# Altium project Control128v4.PrjPcb
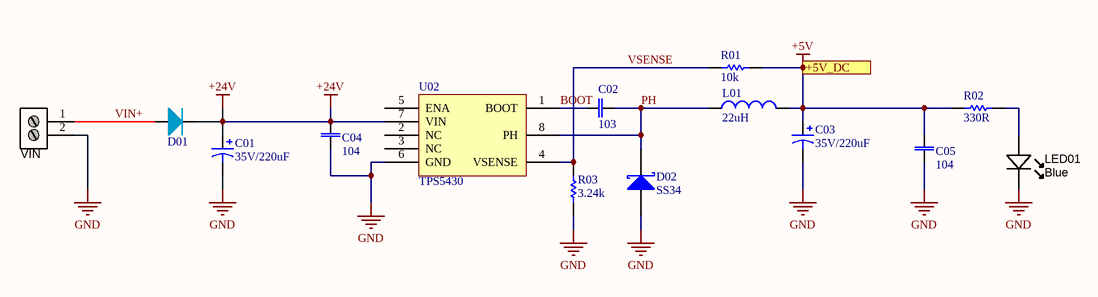
[diagram p0: 0.powerv4.SchDoc]
4 sheets, 98 parts. Net scope: flat (ports and power ports of the same name join across sheets).
Board file: control128v4.PcbDoc
Sheets:
  0.powerv4.SchDoc
  1.mcuv4.SchDoc
  2.rs485v4.SchDoc
  3.relayoutv4.SchDoc

## Sheet 0.powerv4.SchDoc
size A4; DocumentNumber: 1; SheetNumber: 1; SheetTotal: 4

### Parts
C01  value 35V/220uF  [CAPE3.5-5.0MM_Rad_10x14mm]  (hidden comment: Tụ nhôm cắm35V/220uF)
C02  value 103  [CAP 0805]  (hidden comment: Tụ điện dán 0805103)
C03  value 35V/220uF  [CAPE3.5-5.0MM_Rad_10x14mm]  (hidden comment: Tụ nhôm cắm35V/220uF)
C04  value 104  [CAP 0805]  (hidden comment: Tụ điện dán 0805104)
C05  value 104  [CAP 0805]  (hidden comment: Tụ điện dán 0805104)
D01  Đi ốt dán M7chân DO-214AB  [DO-214AA]  (value not drawn)
D02  SS34  [SMD diode]
L01  value 22uH  [Inductor 12x12x6]  (hidden comment: Cuộn cảm dán22uH)
LED01  Blue  [LED-0805-K]
R01  value 10k  [RES 0805]  (hidden comment: Điện trở dán 080510k)
R02  value 330R  [RES 0805]  (hidden comment: Điện trở dán 0805330R)
R03  value 3.24k  [RES 0805]  (hidden comment: Điện trở dán 08053.24k)
U02  TPS5430  [SOIC 8]
VIN  Giắc xanh 5.08mm  [2P_PCB1]  (value not drawn)

### Ports
+5V_DC

### Nets
+5V: C03.1 C05.2 L01.2 R01.1 R02.2 ; port +5V_DC
+24V: C01.1 C04.2 D01.2(K) U02.7(VIN)
GND: C01.2 C03.2 C04.1 C05.1 D02.1(A) LED01.K R03.1 U02.6(GND) VIN.2
BOOT: C02.1 U02.1(BOOT)
PH: C02.2 D02.2(K) L01.1 U02.8(PH)
VIN+: D01.1(A) VIN.1
VSENSE: R01.2 R03.2 U02.4(VSENSE)
NetLED01_A: LED01.A R02.1

Not connected (* = marked no-connect by the designer): U02 2(NC) 3(NC) 5(ENA)

### Library data of the parts
C01 C03 = Cap: cm: Tụ nhôm cắm
C02 C04 C05 = CAP NP: Capacitor non polarized; cm1: Tụ điện dán 0603; cm3: Tụ điện dán 1206; cm2: Tụ điện dán 0805
D01 = Diode: pin to pad: 1>A 2>K; cm1: Đi ốt cắm; vl2: FR307; vl3: TVS 1.5KE300A 19A 300V; vl4: HER508 5A 1000V; cm2: Đi ốt dán M7; vl5: chân DO-214AB
D02 = Diode Schottky: pin to pad: 1>A 2>K
L01 = Inductor: cm2: Cuộn cảm cắm; cm1: Cuộn cảm dán
LED01 = LED_SMD_Blue_0805_100mcd: LED 0805 SMD Blue 100mcd 470nm; Manufacturer 1: Ligitek; Manufacturer Part Number 1: LG-170DBKZ-CT; Material: InGaN/GaN; Ratings: 100 mcd; 470 nm; Package / Case: 0805; Value: Blue; Color: Blue
R01 R02 R03 = Res: Resistor; cm1: Điện trở dán 0603; cm2: Điện trở cắm 1/4W; cm4: Điện trở dán 1206; cm3: Điện trở dán 0805
VIN = 2P_ScrewTerm_90S_3.81MM: Terminal Block Screw Type THT 2-Position 3.81mm pitch; Manufacturer 1: Tyco Electronics; Manufacturer Part Number 1: 1776113-2; Value: 2 position; Pitch: 0.150" (3.81mm); Positions Per Level: 2; Package / Case: Side Entry; 3.81mm pitch; Category: Connectors Interconnects; Color: Black; Supplier 1: Digi-Key; Supplier Part Number 1: A97976-ND; vl: Giắc xanh 5.08mm

## Sheet 1.mcuv4.SchDoc
size A3; DocumentNumber: 2; SheetNumber: 2; SheetTotal: 4; PageSetup: Record=PageOptions|CenterHorizontal=True|CenterVertical=True|PrintScale=0.73|XCorrection=1.00|YCorrection=1.00|PrintKind=1|BorderSize=5000000|LeftOffset=0|BottomOffset=0|Orientation=2|PaperLength=1000|PaperWidth=1000|Scale=100|PaperSource=7|PrintQuality=-3|MediaType=1|DitherType=10|PrintScaleMode=1|PaperKind=A4|PaperIndex=9
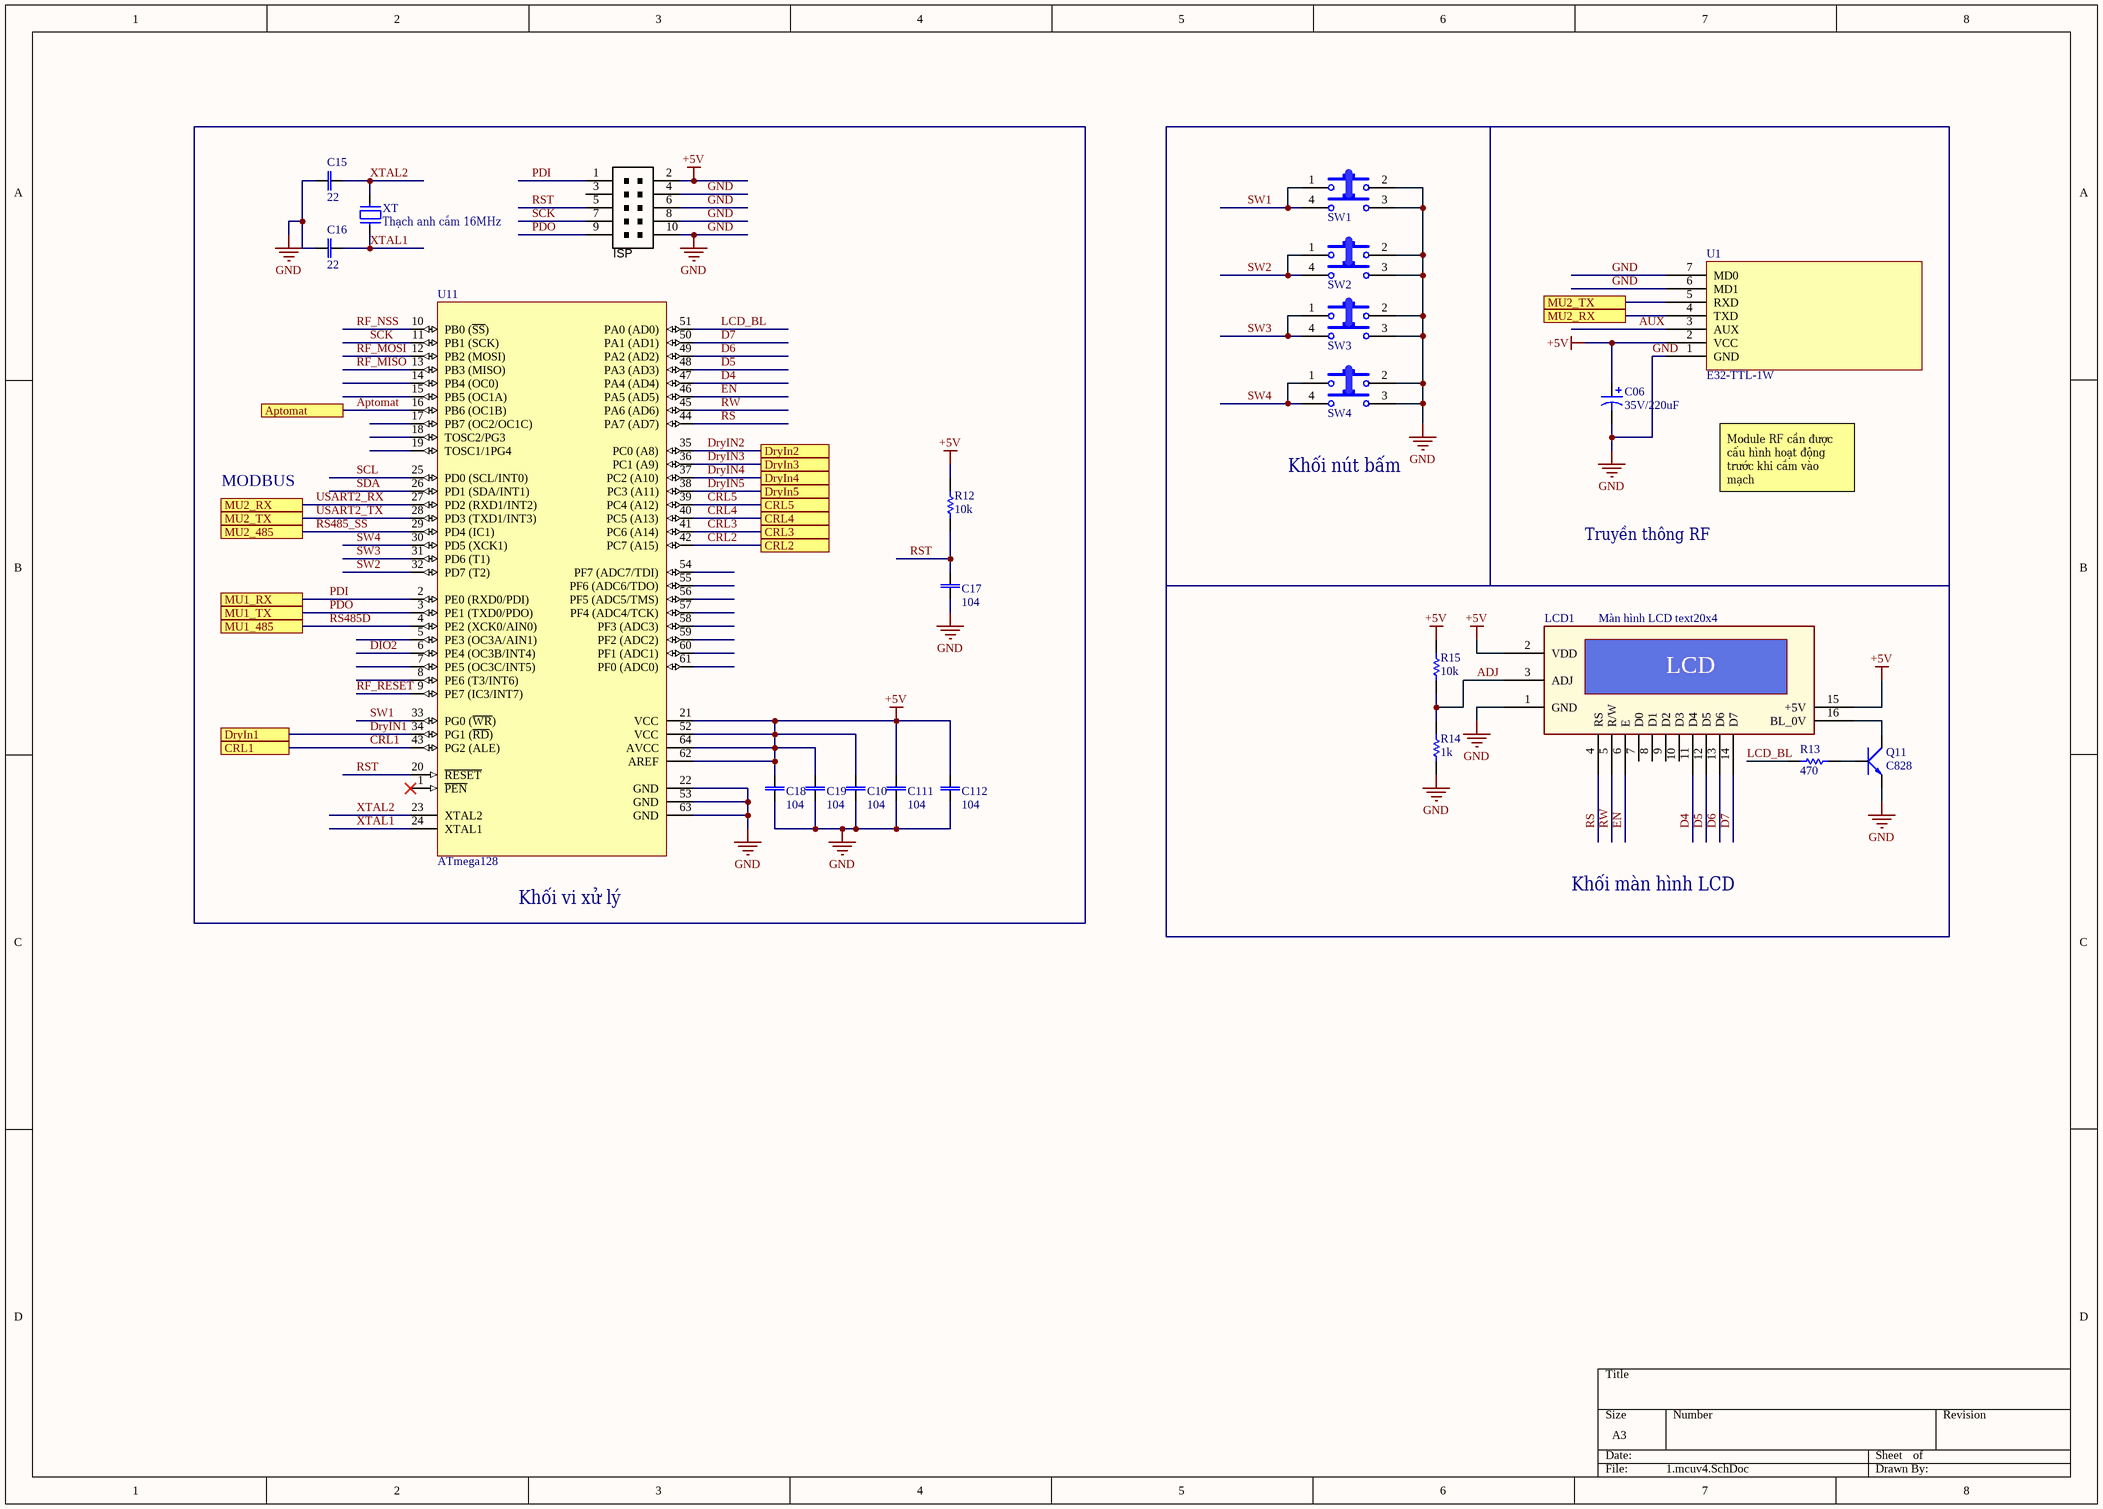
[diagram p1: 1.mcuv4.SchDoc]

### Parts
C06  value 35V/220uF  [CAPE3.5-5.0MM_Rad_10x14mm]  (hidden comment: Tụ nhôm cắm35V/220uF)
C10  value 104  [CAP 0805]  (hidden comment: Tụ điện dán 0805104)
C15  value 22  [CAP 0805]  (hidden comment: Tụ điện dán 080522)
C16  value 22  [CAP 0805]  (hidden comment: Tụ điện dán 080522)
C17  value 104  [CAP 0805]  (hidden comment: Tụ điện dán 0805104)
C18  value 104  [CAP 0805]  (hidden comment: Tụ điện dán 0805104)
C19  value 104  [CAP 0805]  (hidden comment: Tụ điện dán 0805104)
C111  value 104  [CAP 0805]  (hidden comment: Tụ điện dán 0805104)
C112  value 104  [CAP 0805]  (hidden comment: Tụ điện dán 0805104)
ISP  Giắc đôi 5x2 chân 2.54mm  [10P_PCB_HEADER_BRD_MNT]  (value not drawn)
LCD1  Màn hình LCD text20x4  [LCD 20x4]
Q11  C828  [SOT23 TOP]
R12  value 10k  [RES 0805]  (hidden comment: Điện trở dán 080510k)
R13  value 470  [RESC1608N_F]  (hidden comment: Điện trở dán 0805470)
R14  value 1k  [RES 0805]  (hidden comment: Điện trở dán 08051k)
R15  value 10k  [RES 0805]  (hidden comment: Điện trở dán 080510k)
SW1  Nút bấm 4 chân cắm12x12x17mm  [SW 12x12x4]  (value not drawn)
SW2  Nút bấm 4 chân cắm12x12x17mm  [SW 12x12x4]  (value not drawn)
SW3  Nút bấm 4 chân cắm12x12x17mm  [SW 12x12x4]  (value not drawn)
SW4  Nút bấm 4 chân cắm12x12x17mm  [SW 12x12x4]  (value not drawn)
U1  value E32-TTL-1W  [RF_AS32]
U11  ATmega128  [64A_N]
XT  Thạch anh cắm 16MHz  [XT2]

### Blocks framed on the sheet
Khối vi xử lý: C10 C15-C19 C111 C112 ISP R12 U11 XT

### Ports
Aptomat, CRL1, CRL2, CRL3, CRL4, CRL5, DryIn1, DryIn2, DryIn3, DryIn4, DryIn5, MU1_485, MU1_RX, MU1_TX, MU2_485, MU2_RX, MU2_TX

### Nets
+5V: C06.1 C10.2 C18.2 C19.2 C111.2 C112.2 ISP.2 LCD1.2(VDD) LCD1.15(+5V) R12.2 R15.2 U1.2(VCC) U11.21(VCC) U11.52(VCC) U11.62(AREF) U11.64(AVCC)
GND: C06.2 C10.1 C15.2 C16.2 C17.1 C18.1 C19.1 C111.1 C112.1 ISP.4 ISP.6 ISP.8 ISP.10 LCD1.1(GND) Q11.3(E) R14.1 SW1.2 SW1.3 SW2.2 SW2.3 SW3.2 SW3.3 SW4.2 SW4.3 U1.1(GND) U1.6(MD1) U1.7(MD0) U11.22(GND) U11.53(GND) U11.63(GND)
ADJ: LCD1.3(ADJ) R14.2 R15.1
Aptomat: U11.16(PB6_(OC1B)) ; port Aptomat
AUX: U1.3(AUX)
CRL1: U11.43(PG2_(ALE)) ; port CRL1
CRL2: U11.42(PC7_(A15)) ; port CRL2
CRL3: U11.41(PC6_(A14)) ; port CRL3
CRL4: U11.40(PC5_(A13)) ; port CRL4
CRL5: U11.39(PC4_(A12)) ; port CRL5
D4: LCD1.11(D4) U11.47(PA4_(AD4))
D5: LCD1.12(D5) U11.48(PA3_(AD3))
D6: LCD1.13(D6) U11.49(PA2_(AD2))
D7: LCD1.14(D7) U11.50(PA1_(AD1))
DIO2: U11.6(PE4_(OC3B/INT4))
DryIN1: U11.34(PG1_(~{RD})) ; port DryIn1
DryIN2: U11.35(PC0_(A8)) ; port DryIn2
DryIN3: U11.36(PC1_(A9)) ; port DryIn3
DryIN4: U11.37(PC2_(A10)) ; port DryIn4
DryIN5: U11.38(PC3_(A11)) ; port DryIn5
EN: LCD1.6(E) U11.46(PA5_(AD5))
LCD_BL: R13.2 U11.51(PA0_(AD0))
PDI: ISP.1 U11.2(PE0_(RXD0/PDI)) ; port MU1_RX
PDO: ISP.9 U11.3(PE1_(TXD0/PDO)) ; port MU1_TX
RF_MISO: U11.13(PB3_(MISO))
RF_MOSI: U11.12(PB2_(MOSI))
RF_NSS: U11.10(PB0_(~{SS}))
RF_RESET: U11.9(PE7_(IC3/INT7))
RS: LCD1.4(RS) U11.44(PA7_(AD7))
RS485_SS: U11.29(PD4_(IC1)) ; port MU2_485  [project net RD485]
RS485D: U11.4(PE2_(XCK0/AIN0)) ; port MU1_485
RST: C17.2 ISP.5 R12.1 U11.20(~{RESET})
RW: LCD1.5(R/W) U11.45(PA6_(AD6))
SCK: ISP.7 U11.11(PB1_(SCK))
SCL: U11.25(PD0_(SCL/INT0))
SDA: U11.26(PD1_(SDA/INT1))
SW1: SW1.1 SW1.4 U11.33(PG0_(~{WR}))
SW2: SW2.1 SW2.4 U11.32(PD7_(T2))
SW3: SW3.1 SW3.4 U11.31(PD6_(T1))
SW4: SW4.1 SW4.4 U11.30(PD5_(XCK1))
USART2_RX: U1.4(TXD) U11.27(PD2_(RXD1/INT2)) ; port MU2_RX
USART2_TX: U1.5(RXD) U11.28(PD3_(TXD1/INT3)) ; port MU2_TX
XTAL1: C16.1 U11.24(XTAL1) XT.1
XTAL2: C15.1 U11.23(XTAL2) XT.2
NetLCD1_16: LCD1.16(BL_0V) Q11.2(C)
NetQ11_1: Q11.1(B) R13.1

Not connected (* = marked no-connect by the designer): ISP 3; LCD1 7(D0) 8(D1) 9(D2) 10(D3); U11 1(~{PEN})* 5(PE3_(OC3A/AIN1)) 7(PE5_(OC3C/INT5)) 8(PE6_(T3/INT6)) 14(PB4_(OC0)) 15(PB5_(OC1A)) 17(PB7_(OC2/OC1C)) 18(TOSC2/PG3) 19(TOSC1/1PG4) 54(PF7_(ADC7/TDI)) 55(PF6_(ADC6/TDO)) 56(PF5_(ADC5/TMS)) 57(PF4_(ADC4/TCK)) 58(PF3_(ADC3)) 59(PF2_(ADC2)) 60(PF1_(ADC1)) 61(PF0_(ADC0))

### Notes on the sheet
- MODBUS
- (near SW4) Khối nút bấm
- Module RF cần được cấu hình hoạt động trước khi cắm vào mạch
- Truyền thông RF
- Khối màn hình LCD
- (in symbol LCD 16x2) LCD

### Library data of the parts
C06 = Cap: cm: Tụ nhôm cắm
C10 C15-C19 C111 C112 = CAP NP: as C02 on sheet 0.powerv4; cm2: Tụ điện dán 0805
ISP = CONN_HEADER_2x5P_0.100in_Male: Header THD 10 POS Double-row 2.54mm pitch; Manufacturer 1: 3M; Manufacturer Part Number 1: D2510-6002-AR; Pitch: 0.100" (2.54mm); Value: Double-row, 10 positions; QtyOverride: 1; Connector Type: Header, Shrouded; Number of Positions: 10; Package / Case: Connector header; 2.54mm pitch; Contact Type: Male Pin; Number of Rows: 2; Row Spacing: 0.100" (2.54mm); Contact Mating Length: 0.243" (6.17mm); ComponentLink1URL: http://multimedia.3m.com/mws/mediawebserver?66666UuZjcFSLXTtm8T_oxMcEVuQEcuZgVs6EVs6E666666--; ComponentLink1Description: http://multimedia.3m.com/mws/mediawebserver?66666UuZjcFSLXTtm8T_oxMcEVuQEcuZgVs6EVs6E666666--; Supplier 1: Digi-Key; Supplier Part Number 1: MHC10E-ND
LCD1 = LCD 16x2: Text LCD; vl1: 16x2; vl2: 20x4; cm1: Màn hình LCD text
Q11 = NPN: Transistor C828 C1815....
R12-R15 = Res: as R01 on sheet 0.powerv4; cm3: Điện trở dán 0805
SW1-SW4 = SW-4P-Small: pin to pad: 3>2 4>1; cm1: Nút bấm 4 chân cắm; vl1: 12x12x17mm
U1 = AS32-TTL-1W: Type1: Module thu phát không dây RF
U11 = ATmega128-16AC: 8-Bit AVR Microcontroller with 128K Bytes of In-System Programmable Flash Memory; Published: 17-Sep-2003; LatestRevisionDate: 13-Apr-2006; LatestRevisionNote: IPC-7351 Footprint Added.; DatasheetVersion: 2467G-AVR-09/02; PackageVersion: revB, Oct-2001; PackageReference: 64A; Publisher: Altium Limited; PackageDescription: 64-Pin Thin Quad Flat Pack 0.8 mm Pitch; Code_JEDEC: MS-026-AEB; ComponentLink1Description: Manufacturer Link; ComponentLink1URL: http://www.atmel.com; ComponentLink2Description: Datasheet; ComponentLink2URL: http://www.atmel.com/dyn/resources/prod_documents/doc2467.pdf
XT = Crystal

## Sheet 2.rs485v4.SchDoc
size A; DocumentNumber: 3; SheetNumber: 3; SheetTotal: 4; PageSetup: Record=PageOptions|CenterHorizontal=True|CenterVertical=True|PrintScale=1.09|XCorrection=1.00|YCorrection=1.00|PrintKind=1|BorderSize=5000000|LeftOffset=0|BottomOffset=0|Orientation=2|PaperLength=1000|PaperWidth=1000|Scale=100|PaperSource=15|PrintQuality=1200|MediaType=1|DitherType=10|PrintScaleMode=1|PaperKind=A4|PaperIndex=9
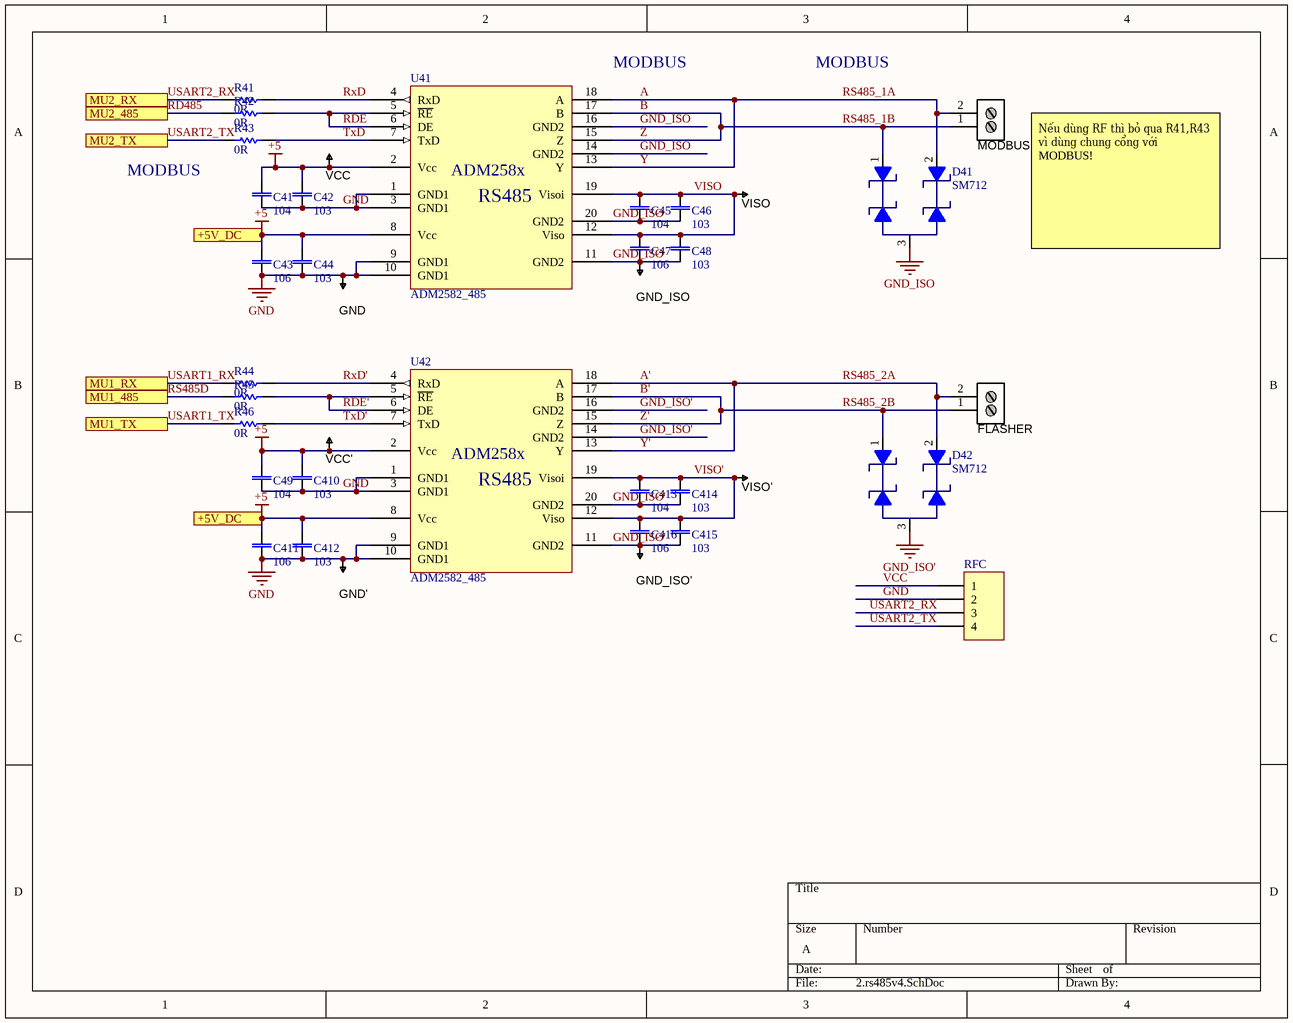
[diagram p2: 2.rs485v4.SchDoc]

### Parts
C41  value 104  [CAP 0805]  (hidden comment: Tụ điện dán 0805104)
C42  value 103  [CAP 0805]  (hidden comment: Tụ điện dán 0805103)
C43  value 106  [CAP 0805]  (hidden comment: Tụ điện dán 0805106)
C44  value 103  [CAP 0805]  (hidden comment: Tụ điện dán 0805103)
C45  value 104  [CAP 0805]  (hidden comment: Tụ điện dán 0805104)
C46  value 103  [CAP 0805]  (hidden comment: Tụ điện dán 0805103)
C47  value 106  [CAP 0805]  (hidden comment: Tụ điện dán 0805106)
C48  value 103  [CAP 0805]  (hidden comment: Tụ điện dán 0805103)
C49  value 104  [CAP 0805]  (hidden comment: Tụ điện dán 0805104)
C410  value 103  [CAP 0805]  (hidden comment: Tụ điện dán 0805103)
C411  value 106  [CAP 0805]  (hidden comment: Tụ điện dán 0805106)
C412  value 103  [CAP 0805]  (hidden comment: Tụ điện dán 0805103)
C413  value 104  [CAP 0805]  (hidden comment: Tụ điện dán 0805104)
C414  value 103  [CAP 0805]  (hidden comment: Tụ điện dán 0805103)
C415  value 103  [CAP 0805]  (hidden comment: Tụ điện dán 0805103)
C416  value 106  [CAP 0805]  (hidden comment: Tụ điện dán 0805106)
D41  SM712  [SOT23 TOP]
D42  SM712  [SOT23 TOP]
FLASHER  Giắc xanh 5.08mm  [2P_PCB1]  (value not drawn)
GND  TESTPOINT  [TP-R60]  (value not drawn)  (no BOM)
GND'  TESTPOINT  [TP-R60]  (value not drawn)  (no BOM)
GND_ISO  TESTPOINT  [TP-R60]  (value not drawn)  (no BOM)
GND_ISO'  TESTPOINT  [TP-R60]  (value not drawn)  (no BOM)
MODBUS  Giắc xanh 5.08mm  [2P_PCB1]  (value not drawn)
R41  value 0R  [RES 0805]  (hidden comment: Điện trở dán 08050R)
R42  value 0R  [RES 0805]  (hidden comment: Điện trở dán 08050R)
R43  value 0R  [RES 0805]  (hidden comment: Điện trở dán 08050R)
R44  value 0R  [RES 0805]  (hidden comment: Điện trở dán 08050R)
R45  value 0R  [RES 0805]  (hidden comment: Điện trở dán 08050R)
R46  value 0R  [RES 0805]  (hidden comment: Điện trở dán 08050R)
RFC  Header 4  [HDR1X4]  (value not drawn)
U41  ADM2582_485  [SO-20B]
U42  ADM2582_485  [SO-20B]
VCC  TESTPOINT  [TP-R60]  (value not drawn)  (no BOM)
VCC'  TESTPOINT  [TP-R60]  (value not drawn)  (no BOM)
VISO  TESTPOINT  [TP-R60]  (value not drawn)  (no BOM)
VISO'  TESTPOINT  [TP-R60]  (value not drawn)  (no BOM)

### Ports
+5V_DC, MU1_485, MU1_RX, MU1_TX, MU2_485, MU2_RX, MU2_TX

### Nets
+5: C41.2 C42.2 C43.2 C44.2 C49.2 C410.2 C411.2 C412.2 U41.2(Vcc) U41.8(Vcc) U42.2(Vcc) U42.8(Vcc) VCC.1 VCC'.1 ; port +5V_DC  [project net +5V]
GND: C41.1 C42.1 C43.1 C44.1 C49.1 C410.1 C411.1 C412.1 GND.1 GND'.1 RFC.2 U41.1(GND1) U41.3(GND1) U41.9(GND1) U41.10(GND1) U42.1(GND1) U42.3(GND1) U42.9(GND1) U42.10(GND1)
GND_ISO: C45.1 C46.1 C47.1 C48.1 D41.3(GND) GND_ISO.1 U41.11(GND2) U41.14(GND2) U41.16(GND2) U41.20(GND2)
GND_ISO': C413.1 C414.1 C415.1 C416.1 D42.3(GND) GND_ISO'.1 U42.11(GND2) U42.14(GND2) U42.16(GND2) U42.20(GND2)
A: D41.2(IO2) MODBUS.2 U41.13(Y) U41.18(A)  [also labelled RS485_1A, Y]
A': D42.2(IO2) FLASHER.2 U42.13(Y) U42.18(A)  [also labelled RS485_2A, Y']
B: D41.1(IO1) MODBUS.1 U41.15(Z) U41.17(B)  [also labelled RS485_1B, Z]
B': D42.1(IO1) FLASHER.1 U42.15(Z) U42.17(B)  [also labelled RS485_2B, Z']
RD485: R42.1 ; port MU2_485
RDE: R42.2 U41.5(~{RE}) U41.6(DE)
RDE': R45.2 U42.5(~{RE}) U42.6(DE)
RS485D: R45.1 ; port MU1_485
RxD: R41.2 U41.4(RxD)
RxD': R44.2 U42.4(RxD)
TxD: R43.2 U41.7(TxD)
TxD': R46.2 U42.7(TxD)
USART1_RX: R44.1 ; port MU1_RX  [project net PDI]
USART1_TX: R46.1 ; port MU1_TX  [project net PDO]
USART2_RX: R41.1 RFC.3 ; port MU2_RX
USART2_TX: R43.1 RFC.4 ; port MU2_TX
VCC: RFC.1
VISO: C45.2 C46.2 C47.2 C48.2 U41.12(Viso) U41.19(Visoi) VISO.1
VISO': C413.2 C414.2 C415.2 C416.2 U42.12(Viso) U42.19(Visoi) VISO'.1

### Notes on the sheet
- (near U41) MODBUS
- MODBUS
- Nếu dùng RF thì bỏ qua R41,R43 vì dùng chung cổng với  MODBUS!
- (in symbol ADM2582_485) ADM258x; RS485

### Library data of the parts
C41-C49 C410-C416 = CAP NP: as C02 on sheet 0.powerv4; cm2: Tụ điện dán 0805
D41 D42 = SM712: The SM712 transient voltage suppressor (TVS) diode  is designed for asymmetrical (12V to -7V) protection  in multi-point data transmission standard RS-485  applications.; pin to pad: 2>3 3>2
FLASHER MODBUS = 2P_ScrewTerm_90S_3.81MM: as VIN on sheet 0.powerv4; Package / Case: Side Entry; 3.81mm pitch; Category: Connectors Interconnects; Color: Black; Supplier 1: Digi-Key; Supplier Part Number 1: A97976-ND; vl: Giắc xanh 5.08mm
GND GND' GND_ISO GND_ISO' VCC VCC' VISO VISO' = TESTPOINT: SMD test pin
R41-R46 = Res: as R01 on sheet 0.powerv4; cm3: Điện trở dán 0805
RFC = Header 4: Header, 4-Pin; LatestRevisionDate: 17-Jul-2002; LatestRevisionNote: Re-released for DXP Platform.; Publisher: Altium Limited

## Sheet 3.relayoutv4.SchDoc
size A4; DocumentNumber: 4; SheetNumber: 4; SheetTotal: 4; PageSetup: Record=PageOptions|CenterHorizontal=True|CenterVertical=True|PrintScale=1.00|XCorrection=1.00|YCorrection=1.00|PrintKind=1|BorderSize=5000000|LeftOffset=0|BottomOffset=0|Orientation=2|PaperLength=1000|PaperWidth=1000|Scale=100|PaperSource=15|PrintQuality=1200|MediaType=1|DitherType=10|PrintScaleMode=1|PaperKind=A4|PaperIndex=9
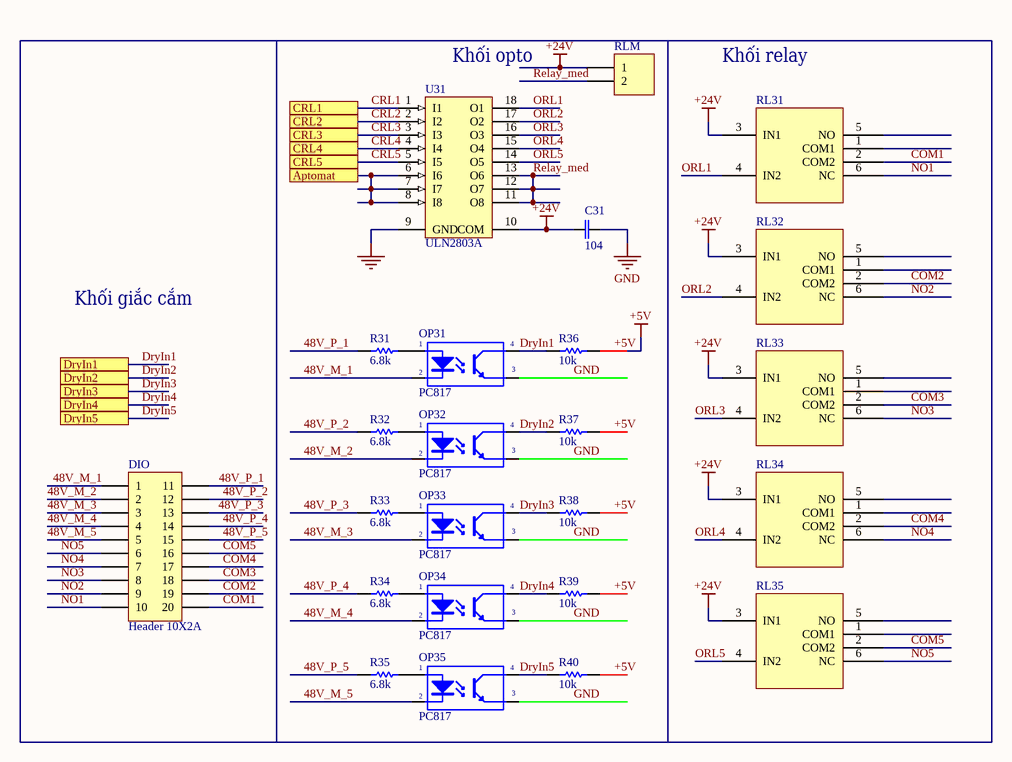
[diagram p3: 3.relayoutv4.SchDoc]

### Parts
C31  value 104  [CAP 0805]  (hidden comment: Tụ điện dán 0805104)
DIO  Header 10X2A  [HDR2X10_CEN]
OP31  PC817  [DIP4/W0.3]
OP32  PC817  [DIP4/W0.3]
OP33  PC817  [DIP4/W0.3]
OP34  PC817  [DIP4/W0.3]
OP35  PC817  [DIP4/W0.3]
R31  value 6.8k  [RESC3216N]  (hidden comment: Điện trở dán 12066.8k)
R32  value 6.8k  [RESC3216N]  (hidden comment: Điện trở dán 12066.8k)
R33  value 6.8k  [RESC3216N]  (hidden comment: Điện trở dán 12066.8k)
R34  value 6.8k  [RESC3216N]  (hidden comment: Điện trở dán 12066.8k)
R35  value 6.8k  [RESC3216N]  (hidden comment: Điện trở dán 12066.8k)
R36  value 10k  [RES 0805]  (hidden comment: Điện trở dán 080510k)
R37  value 10k  [RES 0805]  (hidden comment: Điện trở dán 080510k)
R38  value 10k  [RES 0805]  (hidden comment: Điện trở dán 080510k)
R39  value 10k  [RES 0805]  (hidden comment: Điện trở dán 080510k)
R40  value 10k  [RES 0805]  (hidden comment: Điện trở dán 080510k)
RL31  HK4100F_12V  [HK4100F]  (value not drawn)
RL32  HK4100F_12V  [HK4100F]  (value not drawn)
RL33  HK4100F_12V  [HK4100F]  (value not drawn)
RL34  HK4100F_12V  [HK4100F]  (value not drawn)
RL35  HK4100F_12V  [HK4100F]  (value not drawn)
RLM  Header 2  [HDR1X2]  (value not drawn)
U31  ULN2803A  [SOIC-18]

### Ports
Aptomat, CRL1, CRL2, CRL3, CRL4, CRL5, DryIn1, DryIn2, DryIn3, DryIn4, DryIn5

### Nets
+5V: R36.2 R37.2 R38.2 R39.2 R40.2
+24V: C31.2 RL31.3(IN1) RL32.3(IN1) RL33.3(IN1) RL34.3(IN1) RL35.3(IN1) RLM.1 U31.10(COM)
GND: C31.1 OP31.3(E) OP32.3(E) OP33.3(E) OP34.3(E) OP35.3(E) U31.9(GND)
48V_M_1: DIO.1 OP31.2(K)
48V_M_2: DIO.2 OP32.2(K)
48V_M_3: DIO.3 OP33.2(K)
48V_M_4: DIO.4 OP34.2(K)
48V_M_5: DIO.5 OP35.2(K)
48V_P_1: DIO.11 R31.1
48V_P_2: DIO.12 R32.1
48V_P_3: DIO.13 R33.1
48V_P_4: DIO.14 R34.1
48V_P_5: DIO.15 R35.1
Aptomat: U31.6(I6) U31.7(I7) U31.8(I8) ; port Aptomat
COM1: DIO.20 RL31.2(COM2)
COM2: DIO.19 RL32.2(COM2)
COM3: DIO.18 RL33.2(COM2)
COM4: DIO.17 RL34.2(COM2)
COM5: DIO.16 RL35.2(COM2)
CRL1: U31.1(I1) ; port CRL1
CRL2: U31.2(I2) ; port CRL2
CRL3: U31.3(I3) ; port CRL3
CRL4: U31.4(I4) ; port CRL4
CRL5: U31.5(I5) ; port CRL5
DryIN1: OP31.4(C) R36.1 ; port DryIn1
DryIN2: OP32.4(C) R37.1 ; port DryIn2
DryIN3: OP33.4(C) R38.1 ; port DryIn3
DryIN4: OP34.4(C) R39.1 ; port DryIn4
DryIN5: OP35.4(C) R40.1 ; port DryIn5
NO1: DIO.10 RL31.6(NC)
NO2: DIO.9 RL32.6(NC)
NO3: DIO.8 RL33.6(NC)
NO4: DIO.7 RL34.6(NC)
NO5: DIO.6 RL35.6(NC)
ORL1: RL31.4(IN2) U31.18(O1)
ORL2: RL32.4(IN2) U31.17(O2)
ORL3: RL33.4(IN2) U31.16(O3)
ORL4: RL34.4(IN2) U31.15(O4)
ORL5: RL35.4(IN2) U31.14(O5)
Relay_med: RLM.2 U31.11(O8) U31.12(O7) U31.13(O6)
NetOP31_1: OP31.1(A) R31.2
NetOP32_1: OP32.1(A) R32.2
NetOP33_1: OP33.1(A) R33.2
NetOP34_1: OP34.1(A) R34.2
NetOP35_1: OP35.1(A) R35.2

Not connected (* = marked no-connect by the designer): RL31 1(COM1) 5(NO); RL32 1(COM1) 5(NO); RL33 1(COM1) 5(NO); RL34 1(COM1) 5(NO); RL35 1(COM1) 5(NO)

### Notes on the sheet
- (near U31) Khối opto
- Khối relay
- Khối giắc cắm

### Library data of the parts
C31 = CAP NP: as C02 on sheet 0.powerv4; cm2: Tụ điện dán 0805
DIO = Header 10X2A: Header, 10-Pin, Dual row; LatestRevisionDate: 17-Jul-2002; LatestRevisionNote: Re-released for DXP Platform.; Publisher: Altium Limited
OP31-OP35 = PC817: Single Opto; Value: PC817
R31-R35 = Res: Resistor; cm1: Điện trở dán 0603; cm2: Điện trở cắm 1/4W; cm3: Điện trở dán 0805; cm4: Điện trở dán 1206
R36-R40 = Res: as R01 on sheet 0.powerv4; cm3: Điện trở dán 0805
RL31-RL35 = HK4100F
RLM = Header 2: Header, 2-Pin; LatestRevisionDate: 17-Jul-2002; LatestRevisionNote: Re-released for DXP Platform.; Publisher: Altium Limited
U31 = ULN2803A: High-Voltage, High-Current Darlington Array; LatestRevisionNote: Stylized 3D Model Added.; Publisher: Altium Limited; Value: ULN2803A

## Nets that join several sheets
+5V: 0.powerv4 (5 pins), 1.mcuv4 (16 pins), 2.rs485v4 (14 pins), 3.relayoutv4 (5 pins)
+24V: 0.powerv4 (C01.1 C04.2 D01.2 U02.7), 3.relayoutv4 (8 pins)
GND: 0.powerv4 (9 pins), 1.mcuv4 (30 pins), 2.rs485v4 (19 pins), 3.relayoutv4 (7 pins)
Aptomat: 1.mcuv4 (U11.16), 3.relayoutv4 (U31.6 U31.7 U31.8)
CRL1: 1.mcuv4 (U11.43), 3.relayoutv4 (U31.1)
CRL2: 1.mcuv4 (U11.42), 3.relayoutv4 (U31.2)
CRL3: 1.mcuv4 (U11.41), 3.relayoutv4 (U31.3)
CRL4: 1.mcuv4 (U11.40), 3.relayoutv4 (U31.4)
CRL5: 1.mcuv4 (U11.39), 3.relayoutv4 (U31.5)
DryIN1: 1.mcuv4 (U11.34), 3.relayoutv4 (OP31.4 R36.1)
DryIN2: 1.mcuv4 (U11.35), 3.relayoutv4 (OP32.4 R37.1)
DryIN3: 1.mcuv4 (U11.36), 3.relayoutv4 (OP33.4 R38.1)
DryIN4: 1.mcuv4 (U11.37), 3.relayoutv4 (OP34.4 R39.1)
DryIN5: 1.mcuv4 (U11.38), 3.relayoutv4 (OP35.4 R40.1)
PDI: 1.mcuv4 (ISP.1 U11.2), 2.rs485v4 (R44.1)
PDO: 1.mcuv4 (ISP.9 U11.3), 2.rs485v4 (R46.1)
RD485: 1.mcuv4 (U11.29), 2.rs485v4 (R42.1)
RS485D: 1.mcuv4 (U11.4), 2.rs485v4 (R45.1)
USART2_RX: 1.mcuv4 (U1.4 U11.27), 2.rs485v4 (R41.1 RFC.3)
USART2_TX: 1.mcuv4 (U1.5 U11.28), 2.rs485v4 (R43.1 RFC.4)